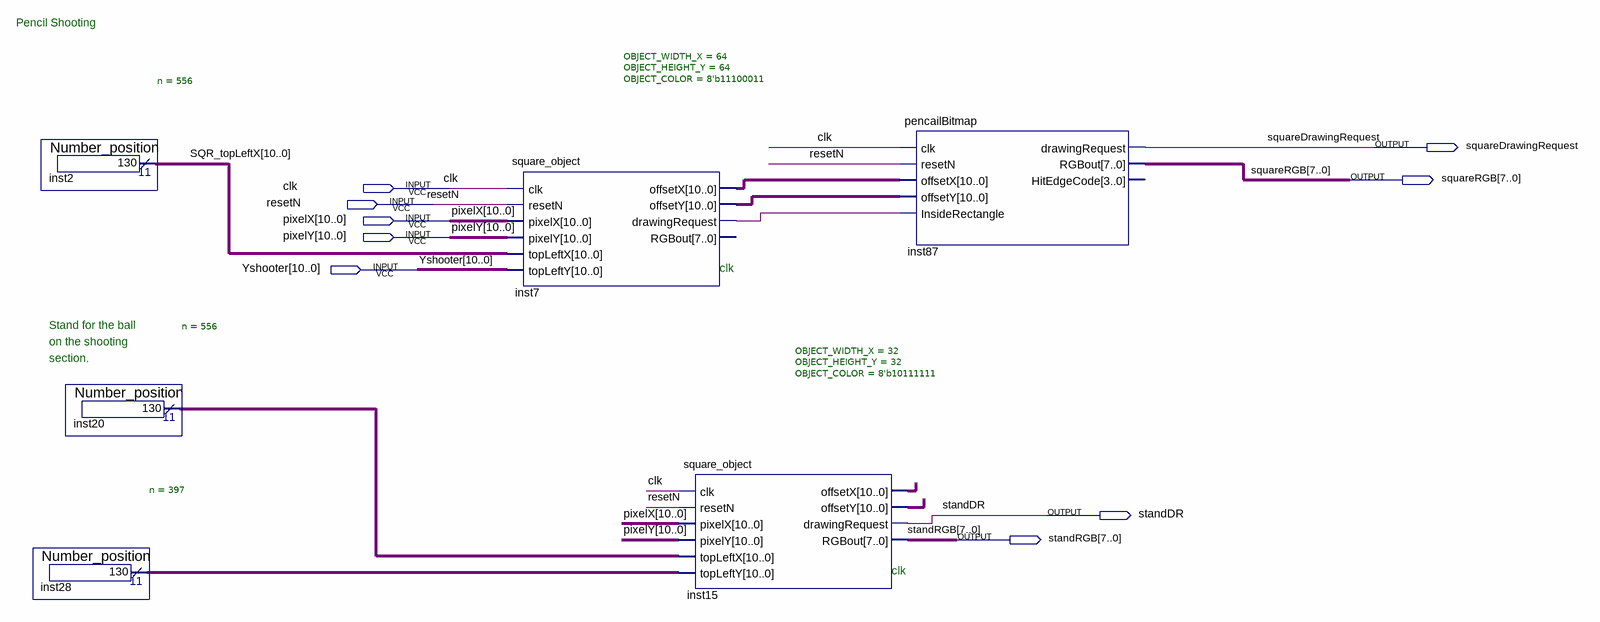
[diagram p0: schematic sheet]
// Quartus schematic Shooting_Block.bdf as structural Verilog: 6 symbols, 9 pins
module Shooting_Block (
  input  clk,
  input  resetN,
  input  [10:0] pixelX,
  input  [10:0] pixelY,
  input  [10:0] Yshooter,
  output squareDrawingRequest,
  output [7:0] squareRGB,
  output standDR,
  output [7:0] standRGB
);

  wire inst7_drawingrequest;
  wire [10:0] inst7_offsetx, inst7_offsety, inst15_offsetx, inst15_offsety, inst20_result, inst28_result,
       SQR_topLeftX;

  Number_position #(.n(556)) inst2 (.result(SQR_topLeftX));
  Number_position #(.n(556)) inst20 (.result(inst20_result));
  Number_position #(.n(397)) inst28 (.result(inst28_result));
  square_object #(.OBJECT_WIDTH_X(64), .OBJECT_HEIGHT_Y(64), .OBJECT_COLOR(8'b11100011)) inst7 (
    .clk(clk), .resetN(resetN), .pixelX(pixelX), .pixelY(pixelY), .topLeftX(SQR_topLeftX),
    .topLeftY(Yshooter), .offsetX(inst7_offsetx), .offsetY(inst7_offsety),
    .drawingRequest(inst7_drawingrequest));  // open: RGBout
  square_object #(.OBJECT_WIDTH_X(32), .OBJECT_HEIGHT_Y(32), .OBJECT_COLOR(8'b10111111)) inst15 (
    .clk(clk), .resetN(resetN), .pixelX(pixelX), .pixelY(pixelY), .topLeftX(inst20_result),
    .topLeftY(inst28_result), .offsetX(inst15_offsetx), .offsetY(inst15_offsety), .drawingRequest(standDR),
    .RGBout(standRGB));
  pencailBitmap inst87 (
    .clk(clk), .resetN(resetN), .offsetX(inst7_offsetx), .offsetY(inst7_offsety),
    .InsideRectangle(inst7_drawingrequest), .drawingRequest(squareDrawingRequest), .RGBout(squareRGB));  // open: HitEdgeCode

  // Notes on the sheet:
  //   Pencil Shooting
  //   clk
  //   Stand for the ball 
  //   on the shooting
  //   section.
  //   clk
endmodule
